# EAGLE design connector_interface (EAGLE 7.7.0)
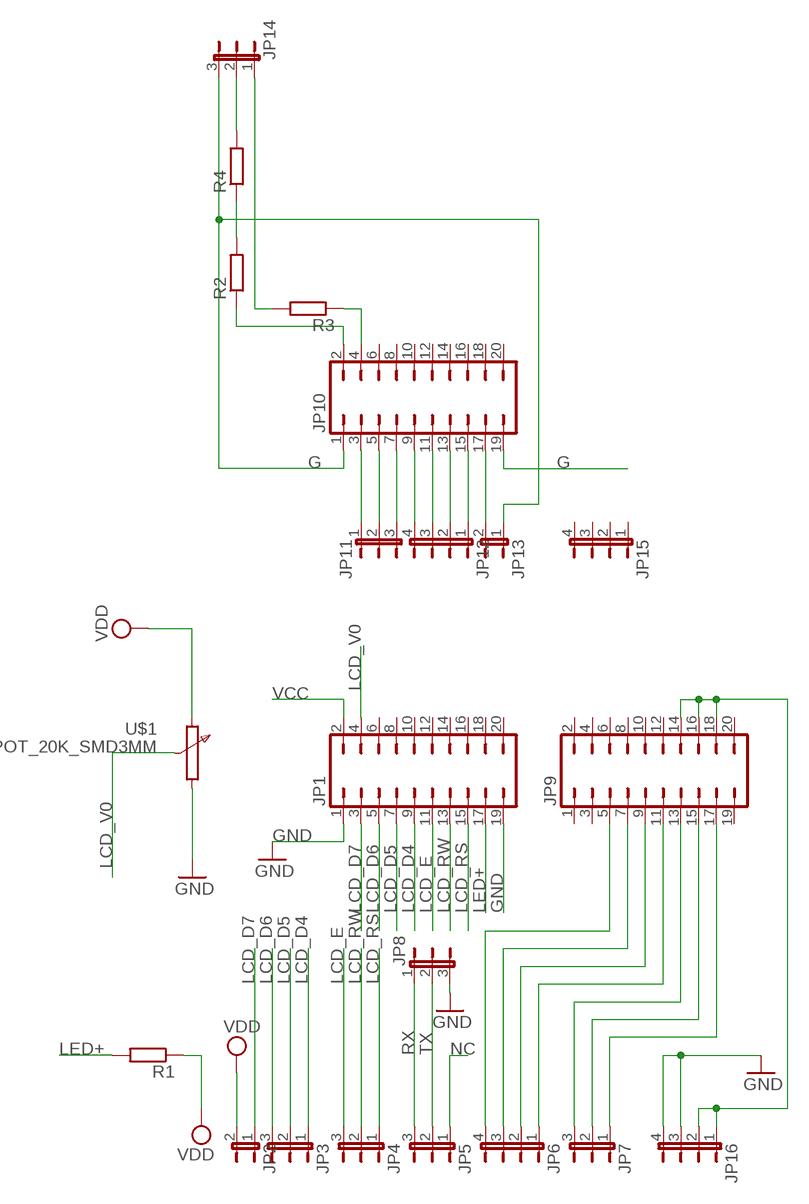
[diagram p0: schematic, sheet 1]

## Parts
JP1  JP10Q  [JP10Q]
JP2  JP1E  [JP1]
JP3  JP2E  [JP2]
JP4  JP2E  [JP2]
JP5  JP2E  [JP2]
JP6  JP4E  [JP4]
JP7  JP2E  [JP2]
JP8  JP2E  [JP2]
JP9  JP10Q  [JP10Q]
JP10  JP10Q  [JP10Q]
JP11  JP2E  [JP2]
JP12  JP4E  [JP4]
JP13  JP1E  [JP1]
JP14  JP2E  [JP2]
JP15  JP4E  [JP4]
JP16  JP4E  [JP4]
R1  R-EU_R1206  [R1206]
R2  R-EU_R1206  [R1206]
R3  R-EU_R1206  [R1206]
R4  R-EU_R1206  [R1206]
U$1  POT_20K_SMD3MM  [POT_3MM_SMD]

## Nets
G: JP10.1 JP10.19 JP13.1 JP14.3
GND: JP1.1 JP1.19 JP8.3 JP16.3 JP16.4 U$1.1
LCD_D4: JP1.9 JP3.1
LCD_D5: JP1.7 JP3.2
LCD_D6: JP1.5 JP3.3
LCD_D7: JP1.3 JP2.1
LCD_E: JP1.11 JP4.3
LCD_RS: JP1.15 JP4.1
LCD_RW: JP1.13 JP4.2
LCD_V0: JP1.4 U$1.2
LED+: JP1.17 R1.2
N$1: JP7.1 JP9.17
N$2: JP9.14 JP9.16 JP9.18 JP16.1 JP16.2
N$3: JP10.2 R2.1
N$4: JP14.1 R3.2
N$5: JP10.9 JP12.4
N$6: JP10.3 JP11.1
N$7: JP10.5 JP11.2
N$8: JP10.7 JP11.3
N$9: JP10.17 JP13.2
N$10: JP10.11 JP12.3
N$11: JP10.13 JP12.2
N$12: JP10.15 JP12.1
N$13: JP6.4 JP9.5
N$14: JP6.3 JP9.7
N$15: JP6.2 JP9.9
N$16: JP6.1 JP9.11
N$17: JP7.3 JP9.13
N$18: JP7.2 JP9.15
N$20: JP14.2 R4.2
N$21: JP10.4 R3.1
N$22: R2.2 R4.1
NC: JP5.1
RX: JP5.3 JP8.1
TX: JP5.2 JP8.2
VCC: JP1.2
VDD: JP2.2 R1.1 U$1.3
Unconnected: JP1.6 JP1.8 JP1.10 JP1.12 JP1.14 JP1.16 JP1.18 JP1.20 JP9.1 JP9.2 JP9.3 JP9.4 JP9.6 JP9.8 JP9.10 JP9.12 JP9.19 JP9.20 JP10.6 JP10.8 JP10.10 JP10.12 JP10.14 JP10.16 JP10.18 JP10.20 JP15.1 JP15.2 JP15.3 JP15.4

## Library data of the parts
JP1 JP9 JP10 = jumper:JP10Q: JUMPER
JP2 JP13 = jumper:JP1E: JUMPER
JP3-JP5 JP7 JP8 JP11 JP14 = jumper:JP2E: JUMPER
JP6 JP12 JP15 JP16 = jumper:JP4E: JUMPER
R1-R4 = resistor:R-EU_: RESISTOR, European symbol
U$1 = FM_transmitter:POT_20K_SMD3MM

## Board
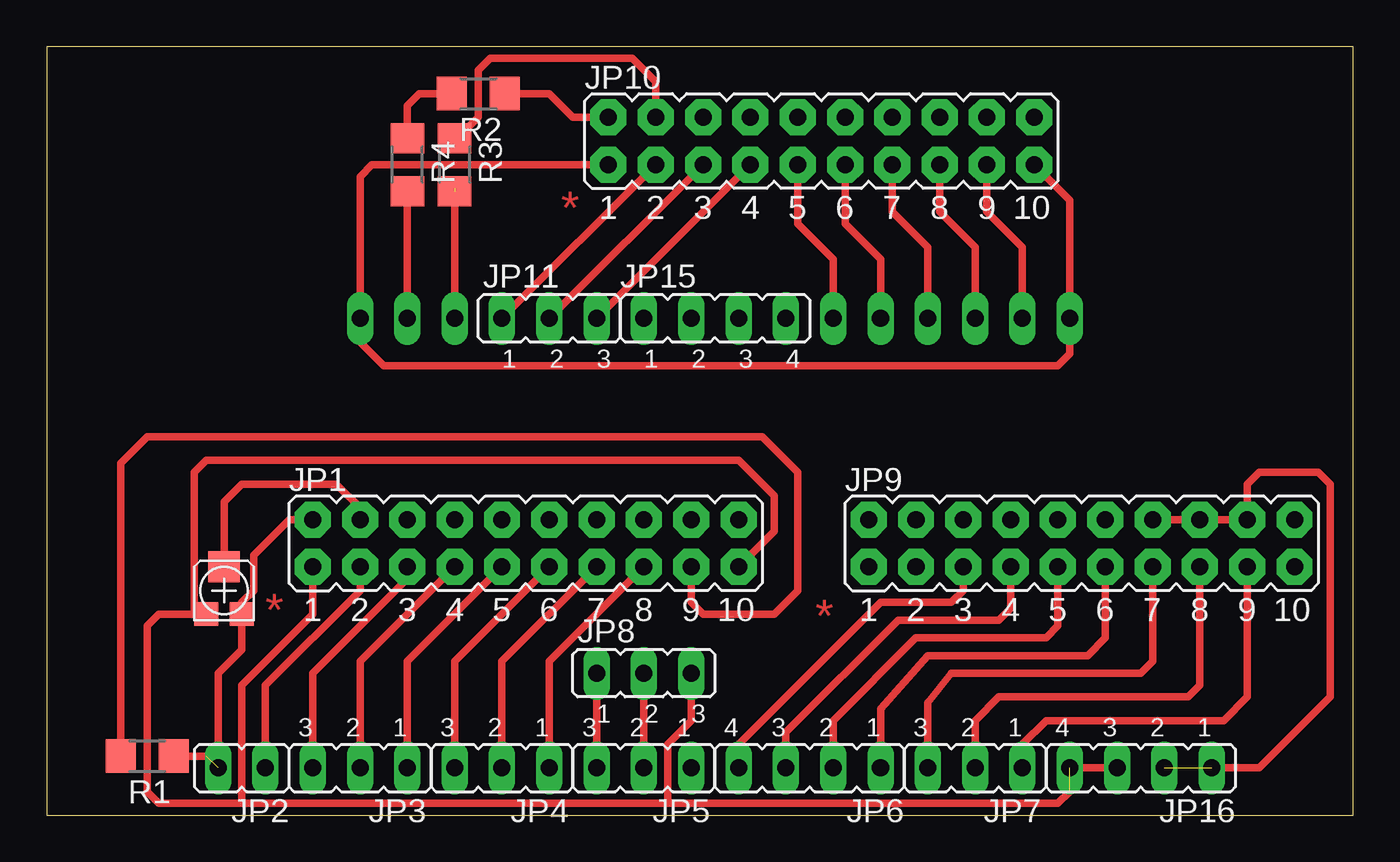
[diagram p1: board, top side]
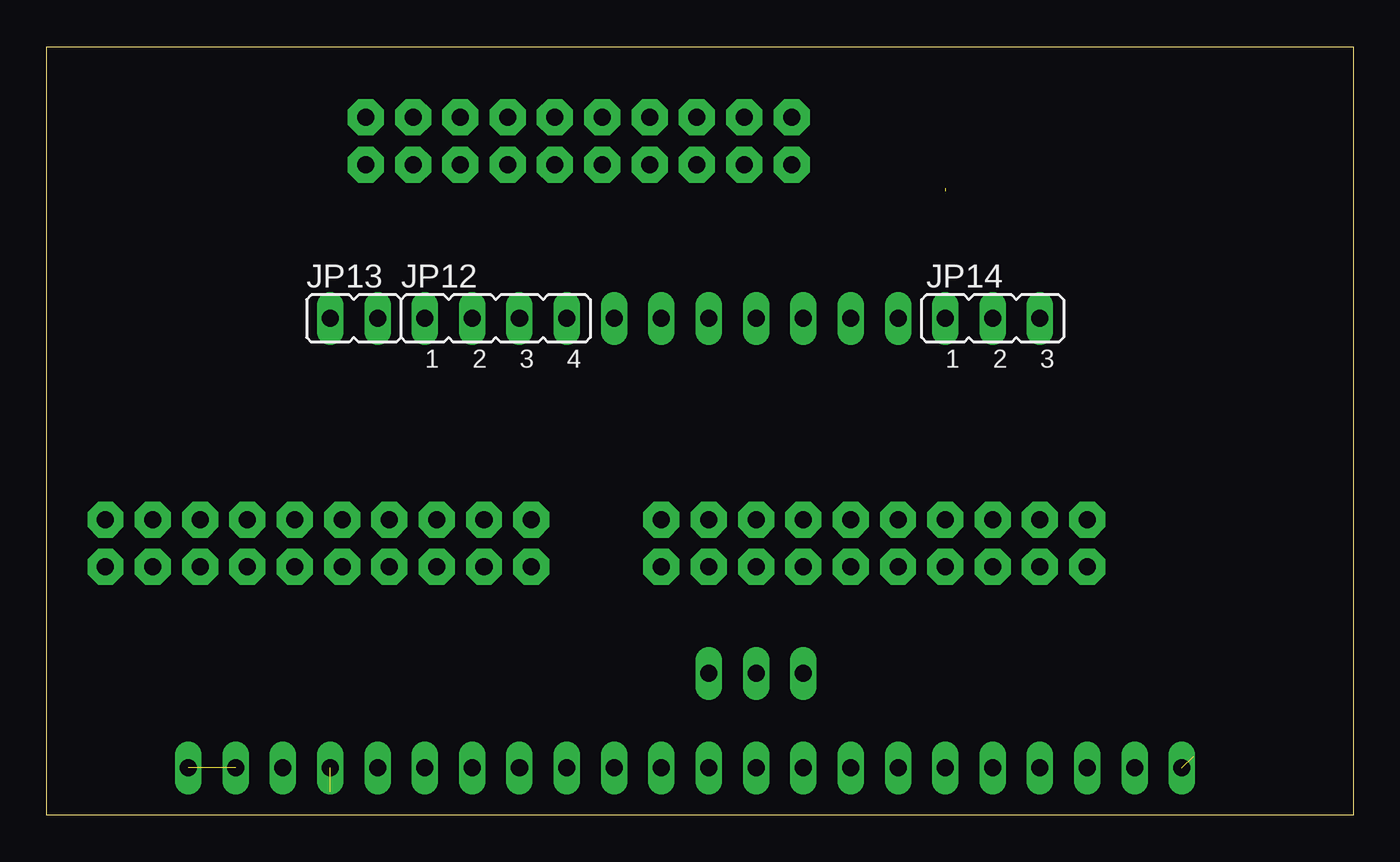
[diagram p2: board, bottom side, seen from below]

Size 70.16 x 41.27 mm. Coordinates in mm from the lower left corner, seen from the top.
Outline: 0,0 70.16,0 70.16,41.27 0,41.27 0,0
Copper layers (1*16): Top 0.035mm / dielectric 1.5mm / Bottom 0.035mm
Design rules "default": minimum track width 10mil, minimum drill 24mil, track to track 8mil, track to pad 8mil, pad to pad 8mil, via to via 8mil, smd to smd 8mil, copper to edge 40mil, drill to drill 8mil, minimum pad ring 10mil, minimum via ring 8mil, stop-mask expansion 4mil, vias tented up to drill 0mil, thermal gap 10mil

### Footprints (pad centres in the part's own frame; a part is rotated, then mirrored left to right if it is on the bottom)
JP10Q = drill 0.914 pad 1.93 octagon: 1 -11.43,-1.27; 2 -11.43,1.27; 3 -8.89,-1.27; 4 -8.89,1.27; 5 -6.35,-1.27; 6 -6.35,1.27; 7 -3.81,-1.27; 8 -3.81,1.27; 9 -1.27,-1.27; 10 -1.27,1.27; 11 1.27,-1.27; 12 1.27,1.27; 13 3.81,-1.27; 14 3.81,1.27; 15 6.35,-1.27; 16 6.35,1.27; 17 8.89,-1.27; 18 8.89,1.27; 19 11.43,-1.27; 20 11.43,1.27
JP1 = drill 0.914 long: 1 0,-1.27; 2 0,1.27
JP2 = drill 0.914 long: 1 -2.54,0; 2 0,0; 3 2.54,0
JP4 = drill 0.914 long: 1 -3.81,0; 2 -1.27,0; 3 1.27,0; 4 3.81,0
R1206 = smd 1.6 x 1.803: 1 -1.422,0; 2 1.422,0
POT_3MM_SMD = smd 1.27 x 1.27: 1 -0.635,0.635; 3 -0.635,-1.27 | smd 1.676 x 1.676: 2 1.905,-0.318

### Placement (x,y rotation side)
JP1  25.72,14.61 0 top
JP2  10.48,2.54 90 top
JP3  16.83,2.54 180 top
JP4  24.45,2.54 180 top
JP5  32.07,2.54 180 top
JP6  40.96,2.54 180 top
JP7  49.85,2.54 180 top
JP8  32.07,7.62 0 top
JP9  55.56,14.61 0 top
JP10  41.59,36.2 0 top
JP11  26.99,26.67 0 top
JP12  46.04,26.67 0 bottom
JP13  53.66,26.67 270 bottom
JP14  19.37,26.67 0 bottom
JP15  35.88,26.67 0 top
JP16  58.74,2.54 180 top
R1  5.4,3.17 180 top
R2  23.18,38.73 180 top
R3  21.91,34.92 270 top
R4  19.37,34.92 270 top
U$1  9.21,11.43 90 top

### Tracks (layer width: path | path; a pad name or v marks a point on that pad's centre or on a via)
G
  Top 0.406: JP10.1 17.46,34.92 16.83,34.29 JP14.3 16.83,25.4 18.1,24.13 54.29,24.13 54.93,24.77 JP13.1 54.93,33.02 JP10.19
GND  (1 unrouted)
  Top 0.406: U$1.1 7.94,10.79 | 7.94,10.79 6.03,10.79 5.4,10.16 5.4,1.27 6.03,0.64 10.48,0.64 | JP1.19 39.05,15.24 39.05,17.14 37.15,19.05 8.57,19.05 7.94,18.41 7.94,10.79 | JP8.3 34.61,5.08 33.34,3.81 33.34,0.64 | 33.34,0.64 54.29,0.64 54.93,1.27 | 33.34,0.64 10.48,0.64 | JP1.1 14.29,10.79 10.48,6.99 10.48,0.64 | JP16.4 JP16.3
LCD_D4
  Top 0.406: JP1.9 19.37,8.26 JP3.1
LCD_D5
  Top 0.406: JP1.7 16.83,8.26 JP3.2
LCD_D6
  Top 0.406: JP1.5 19.37,12.7 14.29,7.62 JP3.3
LCD_D7
  Top 0.406: JP1.3 16.83,12.06 11.75,6.99 JP2.1
LCD_E
  Top 0.406: JP4.3 21.91,8.26 JP1.11
LCD_RS
  Top 0.406: JP4.1 26.99,8.26 JP1.15
LCD_RW
  Top 0.406: JP4.2 24.45,8.26 JP1.13
LCD_V0
  Top 0.406: JP1.4 16.83,16.51 15.56,17.78 10.48,17.78 9.53,16.83 U$1.2
LED+
  Top 0.406: R1.2 3.98,18.9 5.4,20.32 38.42,20.32 40.32,18.41 40.32,12.06 39.05,10.79 35.24,10.79 34.61,11.43 JP1.17
N$1
  Top 0.406: JP7.1 52.39,3.81 53.66,5.08 63.18,5.08 64.45,6.35 JP9.17
N$2  (1 unrouted)
  Top 0.406: JP9.14 JP9.16 JP9.18 64.45,17.78 65.09,18.41 68.26,18.41 68.9,17.78 68.9,6.35 65.09,2.54 JP16.1
N$3
  Top 0.406: JP10.2 28.26,37.47 26.99,38.73 R2.1
N$4  (1 unrouted)
  Top 0.406: 21.91,33.66 JP14.1
N$5
  Top 0.406: JP10.9 40.32,31.75 42.23,29.84 JP12.4
N$6
  Top 0.406: JP10.3 JP11.1
N$7
  Top 0.406: JP10.5 JP11.2
N$8
  Top 0.406: JP10.7 JP11.3
N$9
  Top 0.406: JP10.17 50.48,32.38 52.39,30.48 JP13.2
N$10
  Top 0.406: JP10.11 42.86,31.75 44.77,29.84 JP12.3
N$11
  Top 0.406: JP10.13 45.4,32.38 47.31,30.48 JP12.2
N$12
  Top 0.406: JP10.15 47.94,32.38 49.85,30.48 JP12.1
N$13
  Top 0.406: JP9.5 49.21,12.06 48.58,11.43 44.77,11.43 37.15,3.81 JP6.4
N$14
  Top 0.406: JP9.7 51.75,11.11 51.12,10.48 45.72,10.48 39.69,4.45 JP6.3
N$15
  Top 0.406: JP6.2 42.23,5.08 46.67,9.53 53.66,9.53 54.29,10.16 JP9.9
N$16
  Top 0.406: JP9.11 56.83,9.53 55.88,8.57 47.31,8.57 44.77,5.71 JP6.1
N$17
  Top 0.406: JP9.13 59.37,8.26 58.74,7.62 48.58,7.62 47.31,6.03 JP7.3
N$18
  Top 0.406: JP9.15 61.91,6.99 61.28,6.35 51.12,6.35 49.85,5.08 JP7.2
N$20
  Top 0.406: R4.2 JP14.2
N$21
  Top 0.406: R3.1 22.06,36.35 23.18,37.47 23.18,40.01 23.81,40.64 31.43,40.64 32.7,39.37 JP10.4
N$22
  Top 0.406: R2.2 20,38.73 19.37,38.1 R4.1
RX
  Top 0.406: JP8.1 JP5.3
TX
  Top 0.406: JP8.2 JP5.2
VCC
  Top 0.406: JP1.2 13.02,15.88 11.11,13.97 11.11,12.06 10.48,11.43
VDD  (1 unrouted)
  Top 0.406: R1.1 8.57,3.17 | U$1.3 10.48,8.89 9.21,7.62 JP2.2

### Text on the board
Top: * | * | *